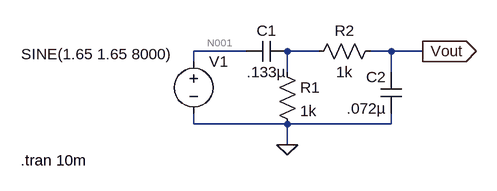
[diagram p0: schematic Draft1.asc]
Draft1.asc, the LTspice schematic file:
Version 4
SHEET 1 880 680
WIRE 48 128 -32 128
WIRE 160 128 112 128
WIRE 272 128 240 128
WIRE 320 128 272 128
WIRE -32 144 -32 128
WIRE 112 160 112 128
WIRE 272 160 272 128
WIRE -32 240 -32 224
WIRE 112 240 -32 240
WIRE 272 240 272 224
WIRE 272 240 112 240
WIRE 112 272 112 240
FLAG 112 272 0
FLAG 320 128 Vout
IOPIN 320 128 Out
SYMBOL cap 112 112 R90
WINDOW 0 0 32 VBottom 2
WINDOW 3 32 32 VTop 2
SYMATTR InstName C1
SYMATTR Value .133µ
SYMBOL cap 288 224 R180
WINDOW 0 24 56 Left 2
WINDOW 3 24 8 Left 2
SYMATTR InstName C2
SYMATTR Value .072µ
SYMBOL res 96 144 R0
SYMATTR InstName R1
SYMATTR Value 1k
SYMBOL res 256 112 R90
WINDOW 0 0 56 VBottom 2
WINDOW 3 32 56 VTop 2
SYMATTR InstName R2
SYMATTR Value 1k
SYMBOL voltage -32 128 R0
WINDOW 3 -265 4 Left 2
WINDOW 123 0 0 Left 0
WINDOW 39 0 0 Left 0
SYMATTR InstName V1
SYMATTR Value SINE(1.65 1.65 8000)
TEXT -298 296 Left 2 !.tran 10m

The netlist it stands for:
* Draft1.asc
C1 N002 N001 .133µ
C2 0 Vout .072µ
R1 N002 0 1k
R2 Vout N002 1k
V1 N001 0 SINE(1.65 1.65 8000)
.tran 10m
.backanno
.end

* Results of the author's LTspice run, read from the files saved beside the schematic
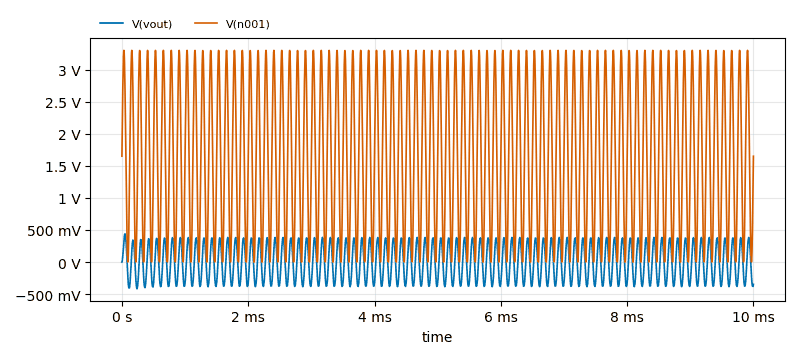
[diagram p1: Transient Analysis of Draft1.asc, plotted from the saved traces]
* Transient Analysis, 1 run:
*   V(vout): min -416.6 mV, max 441 mV, average -402.2 µV, rms 273 mV, last -348.3 mV
*   V(n001): min 261.9 µV, max 3.3 V, average 1.65 V, rms 2.028 V, last 1.65 V